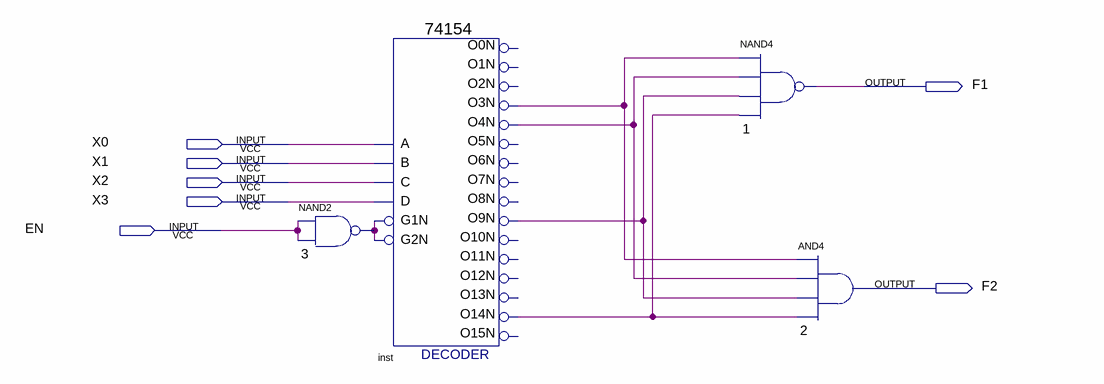
[diagram p0: schematic sheet]
// Quartus schematic DesignB.bdf as structural Verilog: 4 symbols, 7 pins
module DesignB (
  input  X0,
  input  X1,
  input  X2,
  input  X3,
  input  EN,
  output F1,
  output F2
);

  wire inst_o3n, inst_o4n, inst_o9n, inst_o14n, n3_out;

  nand u_3 (n3_out, EN, EN);
  \74154  inst (
    .C(X2), .D(X3), .B(X1), .A(X0), .G1N(n3_out), .G2N(n3_out), .O14N(inst_o14n), .O4N(inst_o4n),
    .O3N(inst_o3n), .O9N(inst_o9n));  // open: O0N, O12N, O15N, O10N, O11N, O1N, O13N, O2N, O7N, O6N, O5N, O8N
  nand u_1 (F1, inst_o3n, inst_o4n, inst_o9n, inst_o14n);
  and u_2 (F2, inst_o3n, inst_o4n, inst_o9n, inst_o14n);
endmodule
